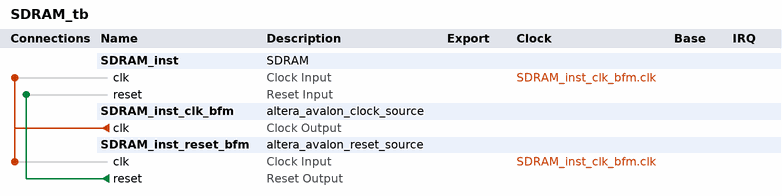
[diagram p0: system contents]
# Platform Designer (Qsys) system SDRAM_tb, Cyclone II EP2C70F896C6
# Parameters at their usual value, and those the tool derives, are not listed.
package require -exact qsys 13.0
create_system SDRAM_tb
set_project_property DEVICE_FAMILY {Cyclone II}
set_project_property DEVICE EP2C70F896C6

add_instance SDRAM_inst SDRAM 1.0

add_instance SDRAM_inst_clk_bfm altera_avalon_clock_source 13.0

add_instance SDRAM_inst_reset_bfm altera_avalon_reset_source 13.0
set_instance_parameter_value SDRAM_inst_reset_bfm ASSERT_HIGH_RESET 0
set_instance_parameter_value SDRAM_inst_reset_bfm INITIAL_RESET_CYCLES 50

# connections
add_connection SDRAM_inst_clk_bfm.clk SDRAM_inst.clk clock
add_connection SDRAM_inst_clk_bfm.clk SDRAM_inst_reset_bfm.clk clock
add_connection SDRAM_inst_reset_bfm.reset SDRAM_inst.reset reset

set_interconnect_requirement {$system} qsys_mm.clockCrossingAdapter HANDSHAKE
set_interconnect_requirement {$system} qsys_mm.maxAdditionalLatency 1

save_system SDRAM_tb.qsys
